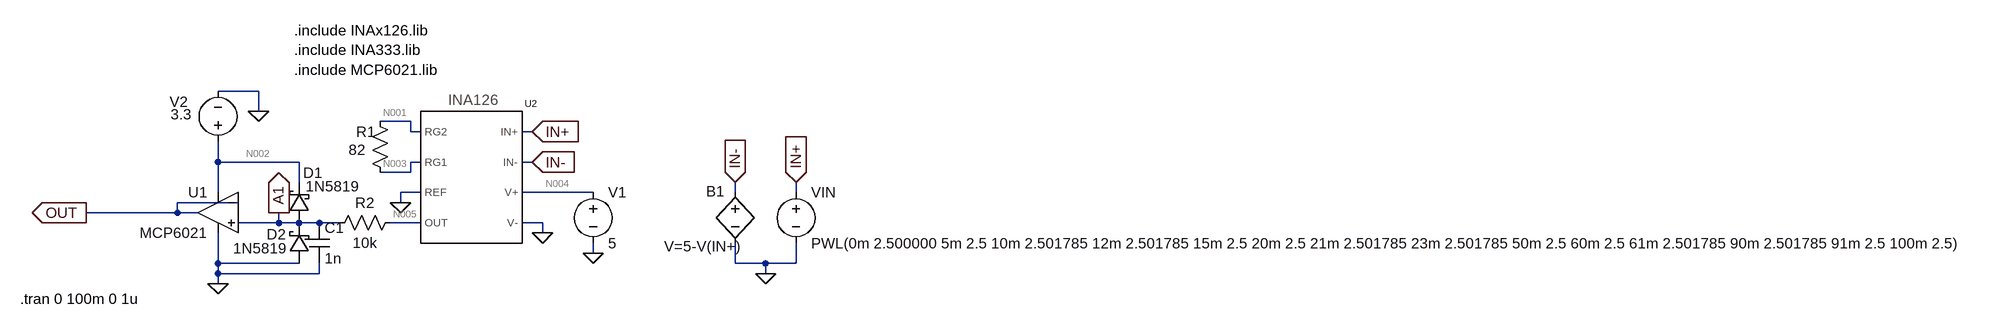
[diagram p0: schematic LoadCellSignal.asc]
LoadCellSignal.asc, the LTspice schematic file:
Version 4.1
SHEET 1 3016 680
WIRE 16 128 -48 128
WIRE 16 160 16 128
WIRE 256 176 208 176
WIRE 256 192 256 176
WIRE 272 192 256 192
WIRE 448 192 432 192
WIRE -48 240 -48 208
WIRE 80 240 -48 240
WIRE 272 240 256 240
WIRE 448 240 432 240
WIRE 256 256 256 240
WIRE 256 256 208 256
WIRE 80 272 80 240
WIRE -48 288 -48 240
WIRE 272 288 240 288
WIRE 544 288 432 288
WIRE 768 288 768 272
WIRE 864 288 864 272
WIRE -16 304 -112 304
WIRE 240 304 240 288
WIRE -112 320 -112 304
WIRE -112 320 -256 320
WIRE -80 320 -112 320
WIRE 48 336 48 320
WIRE 48 336 -16 336
WIRE 80 336 48 336
WIRE 112 336 80 336
WIRE 144 336 112 336
WIRE 272 336 224 336
WIRE 464 336 432 336
WIRE 464 352 464 336
WIRE 544 384 544 368
WIRE -48 400 -48 352
WIRE 80 400 -48 400
WIRE 768 400 768 368
WIRE 816 400 768 400
WIRE 864 400 864 368
WIRE 864 400 816 400
WIRE -48 416 -48 400
WIRE 112 416 112 400
WIRE 112 416 -48 416
WIRE 816 416 816 400
WIRE -48 432 -48 416
FLAG 464 352 0
FLAG 240 304 0
FLAG 544 384 0
FLAG 16 160 0
FLAG -48 432 0
FLAG -256 320 OUT
IOPIN -256 320 Out
FLAG 48 320 A1
IOPIN 48 320 Out
FLAG 768 272 IN-
IOPIN 768 272 In
FLAG 864 272 IN+
IOPIN 864 272 In
FLAG 816 416 0
FLAG 448 240 IN-
IOPIN 448 240 In
FLAG 448 192 IN+
IOPIN 448 192 In
SYMBOL OpAmps\\opamp2 -48 256 M0
SYMATTR InstName U1
SYMATTR Value MCP6021
SYMBOL voltage 544 272 R0
WINDOW 123 0 0 Left 0
WINDOW 39 0 0 Left 0
SYMATTR InstName V1
SYMATTR Value 5
SYMBOL voltage -48 224 R180
WINDOW 0 47 79 Left 2
WINDOW 3 41 59 Left 2
WINDOW 123 0 0 Left 0
WINDOW 39 0 0 Left 0
SYMATTR InstName V2
SYMATTR Value 3.3
SYMBOL res 192 160 R0
WINDOW 0 -22 32 Left 2
WINDOW 3 -34 61 Left 2
SYMATTR InstName R1
SYMATTR Value 82
SYMBOL res 240 320 R90
WINDOW 0 0 56 VBottom 2
WINDOW 3 32 56 VTop 2
SYMATTR InstName R2
SYMATTR Value 10k
SYMBOL schottky 96 336 R180
WINDOW 0 -21 79 Left 2
WINDOW 3 -79 58 Left 2
SYMATTR InstName D1
SYMATTR Value 1N5819
SYMBOL schottky 96 400 R180
WINDOW 0 36 46 Left 2
WINDOW 3 35 24 Left 2
SYMATTR InstName D2
SYMATTR Value 1N5819
SYMBOL voltage 864 272 R0
WINDOW 123 0 0 Left 0
WINDOW 39 0 0 Left 0
SYMATTR InstName VIN
SYMATTR Value PWL(0m 2.500000 5m 2.5 10m 2.501785 12m 2.501785 15m 2.5 20m 2.5 21m 2.501785 23m 2.501785 50m 2.5 60m 2.5 61m 2.501785 90m 2.501785 91m 2.5 100m 2.5)
SYMBOL bv 768 272 R0
WINDOW 0 -46 14 Left 2
WINDOW 3 -112 101 Left 2
SYMATTR InstName B1
SYMATTR Value V=5-V(IN+)
SYMBOL INAx126 304 176 R0
SYMATTR InstName U2
SYMBOL cap 96 336 R0
SYMATTR InstName C1
SYMATTR Value 1n
TEXT 72 32 Left 2 !.include INAx126.lib\n.include INA333.lib\n.include MCP6021.lib
TEXT -360 456 Left 2 !.tran 0 100m 0 1u

The netlist it stands for:
* LoadCellSignal.asc
X§U1 A1 OUT N002 0 OUT MCP6021  ; pins In+ In- V+ V- OUT
V1 N004 0 5
V2 N002 0 3.3
R1 N001 N003 82
R2 N005 A1 10k
D1 A1 N002 1N5819
D2 0 A1 1N5819
VIN IN+ 0 PWL(0m 2.500000 5m 2.5 10m 2.501785 12m 2.501785 15m 2.5 20m 2.5 21m 2.501785 23m 2.501785 50m 2.5 60m 2.5 61m 2.501785 90m 2.501785 91m 2.5 100m 2.5)
B1 IN- 0 V=5-V(IN+)
X§U2 IN+ IN- N004 0 N005 0 N003 N001 INAx126 INAx126  ; pins IN+ IN- V+ V- OUT REF RG1 RG2
C1 A1 0 1n
.model D D
.lib standard.dio
.include INAx126.lib
.include INA333.lib
.include MCP6021.lib
.tran 0 100m 0 1u
.backanno
.end

* Results of the author's LTspice run, read from the files saved beside the schematic
* Operating Point, zero values left out:
*   V(out) = 536.4 mV
*   V(n004) = 5 V
*   V(n001) = 2.501 V
*   V(n005) = 536 mV
*   V(a1) = 536 mV
*   V(n002) = 3.3 V
*   V(n003) = 2.5 V
*   V(in+) = 2.5 V
*   V(in-) = 2.5 V
*   I(B1) = 19.94 nA
*   I(V2) = -1.133 mA
*   I(R1) = 6.665 µA
*   I(D1) = -31.7 µA
*   I(V1) = -38.41 µA
*   I(R2) = -10.27 pA
*   I(D2) = -31.7 µA
*   I(VIN) = 20.11 nA
*   Ix(u2:3) = -20.11 nA
*   Ix(u2:2) = -19.94 nA
*   Ix(u2:7) = 38.41 µA
*   Ix(u2:4) = -38.25 µA
*   Ix(u2:6) = 10.27 pA
*   Ix(u2:5) = -62.5 µA
*   Ix(u2:1) = 6.665 µA
*   Ix(u2:8) = -6.665 µA
*   Ix(u1:3) = 1.102 mA
*   Ix(u1:4) = -1.102 mA
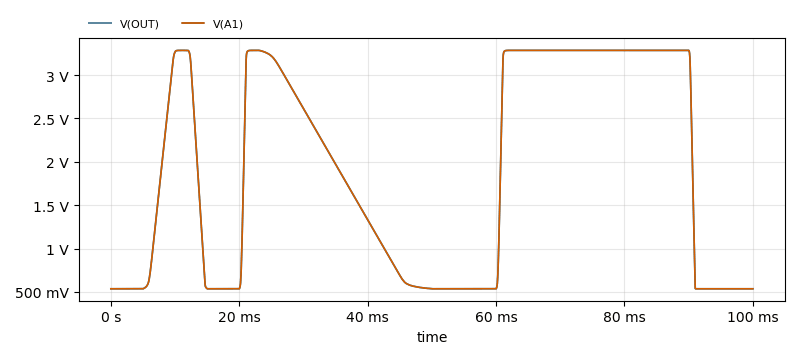
[diagram p1: Transient Analysis of LoadCellSignal.asc, plotted from the saved traces]
* Transient Analysis, 1 run:
*   V(OUT): min 536.4 mV, max 3.285 V, average 1.922 V, rms 2.28 V, last 536.4 mV
*   V(A1): min 536 mV, max 3.285 V, average 1.922 V, rms 2.28 V, last 536 mV